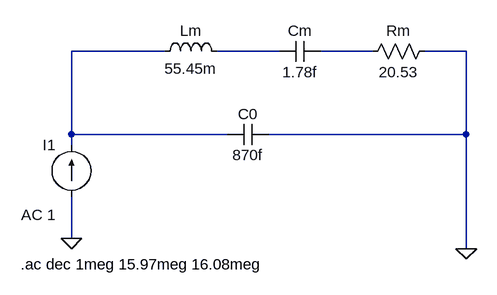
[diagram p0: schematic crystal_simulation.asc]
crystal_simulation.asc, the LTspice schematic file:
Version 4
SHEET 1 880 680
WIRE 176 -16 32 -16
WIRE 352 -16 256 -16
WIRE 496 -16 416 -16
WIRE 640 -16 576 -16
WIRE 32 112 32 -16
WIRE 272 112 32 112
WIRE 640 112 640 -16
WIRE 640 112 336 112
WIRE 32 128 32 112
WIRE 32 272 32 208
WIRE 640 288 640 112
FLAG 32 272 0
FLAG 640 288 0
SYMBOL current 32 208 R180
WINDOW 0 24 80 Left 2
WINDOW 3 24 0 Left 2
WINDOW 123 24 -28 Left 2
WINDOW 39 0 0 Left 0
SYMATTR InstName I1
SYMATTR Value ""
SYMATTR Value2 AC 1
SYMBOL cap 336 96 R90
WINDOW 0 0 32 VBottom 2
WINDOW 3 32 32 VTop 2
SYMATTR InstName C0
SYMATTR Value 870f
SYMBOL cap 416 -32 R90
WINDOW 0 0 32 VBottom 2
WINDOW 3 32 32 VTop 2
SYMATTR InstName Cm
SYMATTR Value 1.78f
SYMBOL ind 160 0 R270
WINDOW 0 32 56 VTop 2
WINDOW 3 5 56 VBottom 2
SYMATTR InstName Lm
SYMATTR Value 55.45m
SYMBOL res 592 -32 R90
WINDOW 0 0 56 VBottom 2
WINDOW 3 32 56 VTop 2
SYMATTR InstName Rm
SYMATTR Value 20.53
TEXT -46 312 Left 2 !.ac dec 1meg 15.97meg 16.08meg

The netlist it stands for:
* crystal_simulation.asc
I1 0 N001 AC 1
C0 0 N001 870f
Cm N003 N002 1.78f
Lm N001 N002 55.45m
Rm 0 N003 20.53
.ac dec 1meg 15.97meg 16.08meg
.backanno
.end